# Altium project STC8H8K64U流水灯.PrjPcb
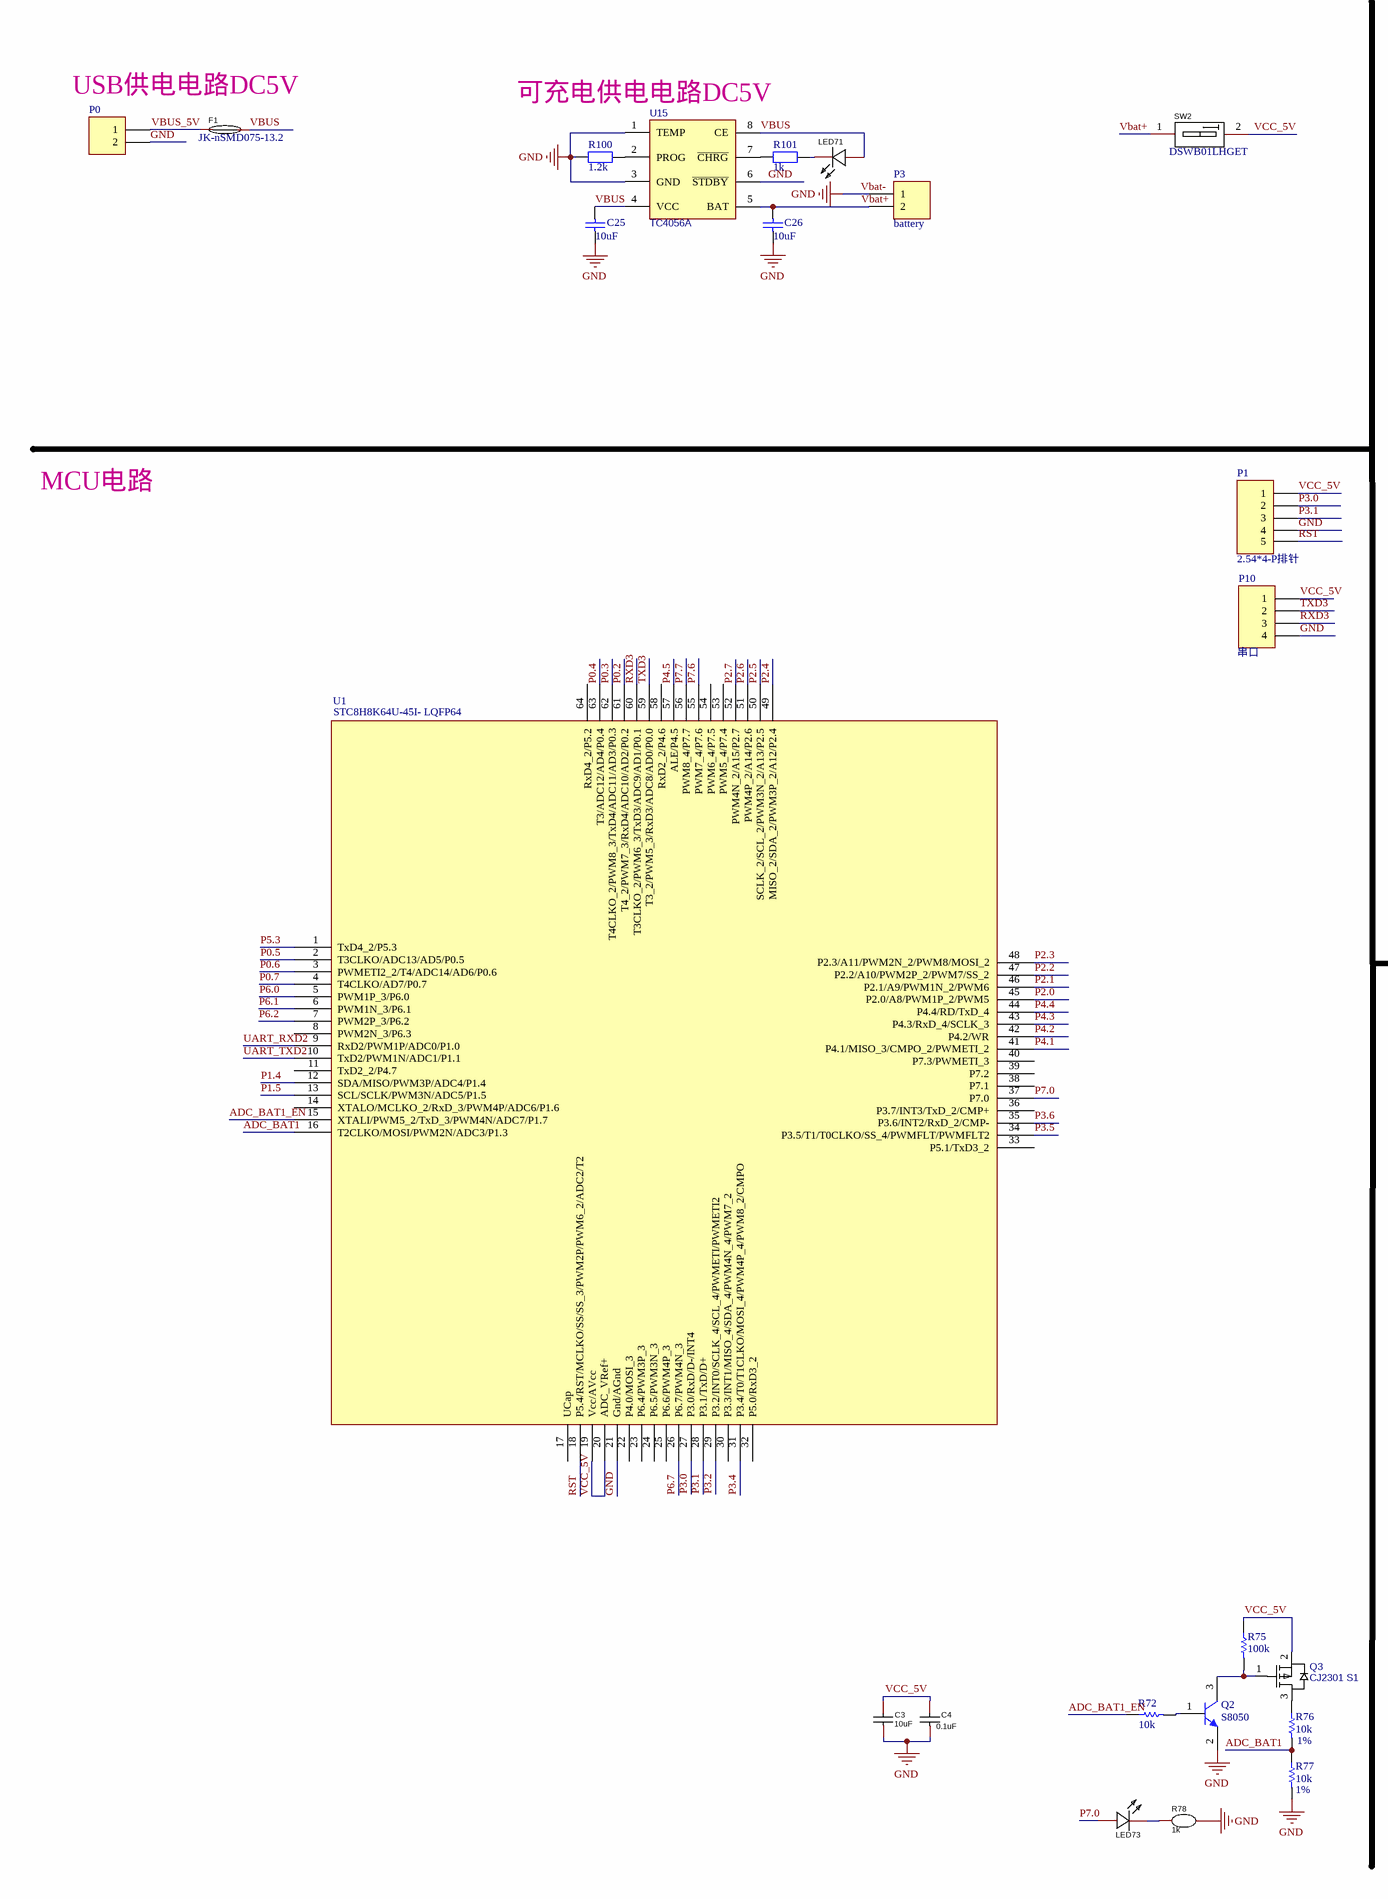
[diagram p0: STC8H8K64U流水灯.SchDoc, left]
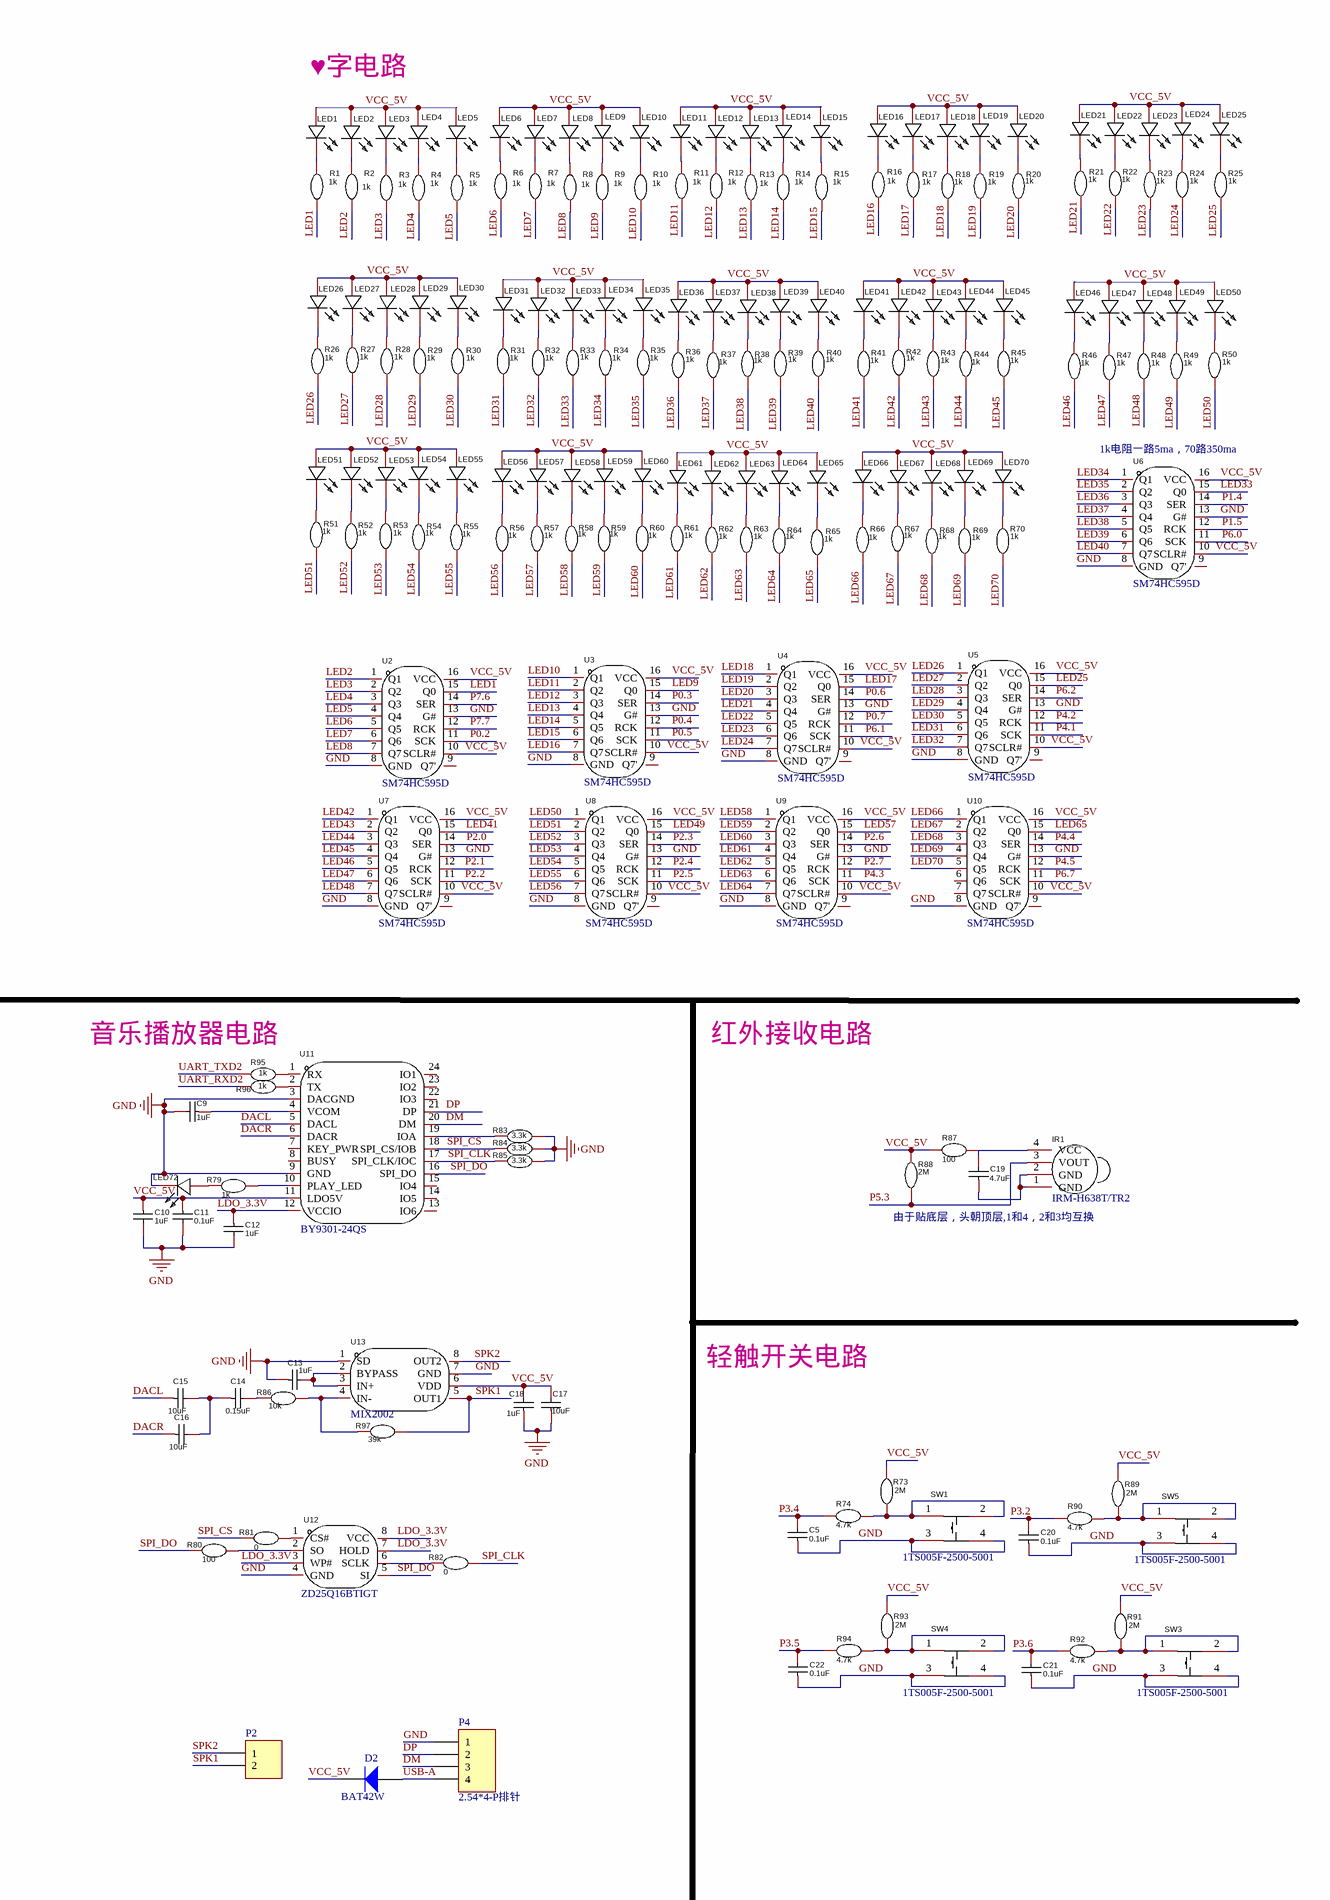
[diagram p1: STC8H8K64U流水灯.SchDoc, right]
1 sheet, 220 parts. Net scope: global (net labels, ports and power ports of the same name join across sheets).
Board file: STC8H8K64U流水灯.PcbDoc

## Sheet STC8H8K64U流水灯.SchDoc
size A2; SheetNumber: 1; SheetTotal: 1; PageSetup: Record=PageOptions|CenterHorizontal=True|CenterVertical=True|PrintScale=0.73|XCorrection=1.00|YCorrection=1.00|PrintKind=0|BorderSize=5000000|LeftOffset=0|BottomOffset=0|Orientation=2|PaperLength=1000|PaperWidth=1000|Scale=100|PaperSource=7|PrintQuality=-3|MediaType=1|DitherType=10|PaperKind=A4|PrintScaleMode=1

### Parts
C3  value 10uF  [C0603]
C4  value 0.1uF  [C0603]
C5  value 0.1uF  [C0603]
C9  value 1uF  [C0603]
C10  value 1uF  [C0603]
C11  value 0.1uF  [C0603]
C12  value 1uF  [C0603]
C13  value 1uF  [C0603]
C14  value 0.15uF  [C0603]
C15  value 10uF  [C0603]
C16  value 10uF  [C0603]
C17  value 10uF  [C0603]
C18  value 1uF  [C0603]
C19  value 4.7uF  [C0603]
C20  value 0.1uF  [C0603]
C21  value 0.1uF  [C0603]
C22  value 0.1uF  [C0603]
C25  value 10uF  [C0603]  (hidden comment: Cap)
C26  value 10uF  [C0603]  (hidden comment: Cap)
D2  BAT42W  [SOD-123]
F1  JK-nSMD075-13.2  [F1206]
IR1  IRM-H638T/TR2  [SMD-4P_IRM-H638T/TR2]
LED1  TLMG1100-GS08  [LED0603]  (value not drawn)
LED2  TLMG1100-GS08  [LED0603]  (value not drawn)
LED3  TLMG1100-GS08  [LED0603]  (value not drawn)
LED4  TLMG1100-GS08  [LED0603]  (value not drawn)
LED5  TLMG1100-GS08  [LED0603]  (value not drawn)
LED6  TLMG1100-GS08  [LED0603]  (value not drawn)
LED7  TLMG1100-GS08  [LED0603]  (value not drawn)
LED8  TLMG1100-GS08  [LED0603]  (value not drawn)
LED9  TLMG1100-GS08  [LED0603]  (value not drawn)
LED10  TLMG1100-GS08  [LED0603]  (value not drawn)
LED11  TLMG1100-GS08  [LED0603]  (value not drawn)
LED12  TLMG1100-GS08  [LED0603]  (value not drawn)
LED13  TLMG1100-GS08  [LED0603]  (value not drawn)
LED14  TLMG1100-GS08  [LED0603]  (value not drawn)
LED15  TLMG1100-GS08  [LED0603]  (value not drawn)
LED16  TLMG1100-GS08  [LED0603]  (value not drawn)
LED17  TLMG1100-GS08  [LED0603]  (value not drawn)
LED18  TLMG1100-GS08  [LED0603]  (value not drawn)
LED19  TLMG1100-GS08  [LED0603]  (value not drawn)
LED20  TLMG1100-GS08  [LED0603]  (value not drawn)
LED21  TLMG1100-GS08  [LED0603]  (value not drawn)
LED22  TLMG1100-GS08  [LED0603]  (value not drawn)
LED23  TLMG1100-GS08  [LED0603]  (value not drawn)
LED24  TLMG1100-GS08  [LED0603]  (value not drawn)
LED25  TLMG1100-GS08  [LED0603]  (value not drawn)
LED26  TLMG1100-GS08  [LED0603]  (value not drawn)
LED27  TLMG1100-GS08  [LED0603]  (value not drawn)
LED28  TLMG1100-GS08  [LED0603]  (value not drawn)
LED29  TLMG1100-GS08  [LED0603]  (value not drawn)
LED30  TLMG1100-GS08  [LED0603]  (value not drawn)
LED31  TLMG1100-GS08  [LED0603]  (value not drawn)
LED32  TLMG1100-GS08  [LED0603]  (value not drawn)
LED33  TLMG1100-GS08  [LED0603]  (value not drawn)
LED34  TLMG1100-GS08  [LED0603]  (value not drawn)
LED35  TLMG1100-GS08  [LED0603]  (value not drawn)
LED36  TLMG1100-GS08  [LED0603]  (value not drawn)
LED37  TLMG1100-GS08  [LED0603]  (value not drawn)
LED38  TLMG1100-GS08  [LED0603]  (value not drawn)
LED39  TLMG1100-GS08  [LED0603]  (value not drawn)
LED40  TLMG1100-GS08  [LED0603]  (value not drawn)
LED41  TLMG1100-GS08  [LED0603]  (value not drawn)
LED42  TLMG1100-GS08  [LED0603]  (value not drawn)
LED43  TLMG1100-GS08  [LED0603]  (value not drawn)
LED44  TLMG1100-GS08  [LED0603]  (value not drawn)
LED45  TLMG1100-GS08  [LED0603]  (value not drawn)
LED46  TLMG1100-GS08  [LED0603]  (value not drawn)
LED47  TLMG1100-GS08  [LED0603]  (value not drawn)
LED48  TLMG1100-GS08  [LED0603]  (value not drawn)
LED49  TLMG1100-GS08  [LED0603]  (value not drawn)
LED50  TLMG1100-GS08  [LED0603]  (value not drawn)
LED51  TLMG1100-GS08  [LED0603]  (value not drawn)
LED52  TLMG1100-GS08  [LED0603]  (value not drawn)
LED53  TLMG1100-GS08  [LED0603]  (value not drawn)
LED54  TLMG1100-GS08  [LED0603]  (value not drawn)
LED55  TLMG1100-GS08  [LED0603]  (value not drawn)
LED56  TLMG1100-GS08  [LED0603]  (value not drawn)
LED57  TLMG1100-GS08  [LED0603]  (value not drawn)
LED58  TLMG1100-GS08  [LED0603]  (value not drawn)
LED59  TLMG1100-GS08  [LED0603]  (value not drawn)
LED60  TLMG1100-GS08  [LED0603]  (value not drawn)
LED61  TLMG1100-GS08  [LED0603]  (value not drawn)
LED62  TLMG1100-GS08  [LED0603]  (value not drawn)
LED63  TLMG1100-GS08  [LED0603]  (value not drawn)
LED64  TLMG1100-GS08  [LED0603]  (value not drawn)
LED65  TLMG1100-GS08  [LED0603]  (value not drawn)
LED66  TLMG1100-GS08  [LED0603]  (value not drawn)
LED67  TLMG1100-GS08  [LED0603]  (value not drawn)
LED68  TLMG1100-GS08  [LED0603]  (value not drawn)
LED69  TLMG1100-GS08  [LED0603]  (value not drawn)
LED70  TLMG1100-GS08  [LED0603]  (value not drawn)
LED71  TLMG1100-GS08  [LED0603]  (value not drawn)
LED72  TLMG1100-GS08  [LED0603]  (value not drawn)
LED73  TLMG1100-GS08  [LED0603]  (value not drawn)
P0  (no value)  [STM-2P]
P1  2.54*4-P排针  [STM-5P]
P2  (no value)  [STM-2P]
P3  battery  [STM-2P]
P4  2.54*4-P排针  [STM-4P]
P10  串口  [STM-4P]
Q2  S8050  [SOT-23]
Q3  CJ2301 S1  [SOT-23]
R1  value 1k  [R0603]
R2  value 1k  [R0603]
R3  value 1k  [R0603]
R4  value 1k  [R0603]
R5  value 1k  [R0603]
R6  value 1k  [R0603]
R7  value 1k  [R0603]
R8  value 1k  [R0603]
R9  value 1k  [R0603]
R10  value 1k  [R0603]
R11  value 1k  [R0603]
R12  value 1k  [R0603]
R13  value 1k  [R0603]
R14  value 1k  [R0603]
R15  value 1k  [R0603]
R16  value 1k  [R0603]
R17  value 1k  [R0603]
R18  value 1k  [R0603]
R19  value 1k  [R0603]
R20  value 1k  [R0603]
R21  value 1k  [R0603]
R22  value 1k  [R0603]
R23  value 1k  [R0603]
R24  value 1k  [R0603]
R25  value 1k  [R0603]
R26  value 1k  [R0603]
R27  value 1k  [R0603]
R28  value 1k  [R0603]
R29  value 1k  [R0603]
R30  value 1k  [R0603]
R31  value 1k  [R0603]
R32  value 1k  [R0603]
R33  value 1k  [R0603]
R34  value 1k  [R0603]
R35  value 1k  [R0603]
R36  value 1k  [R0603]
R37  value 1k  [R0603]
R38  value 1k  [R0603]
R39  value 1k  [R0603]
R40  value 1k  [R0603]
R41  value 1k  [R0603]
R42  value 1k  [R0603]
R43  value 1k  [R0603]
R44  value 1k  [R0603]
R45  value 1k  [R0603]
R46  value 1k  [R0603]
R47  value 1k  [R0603]
R48  value 1k  [R0603]
R49  value 1k  [R0603]
R50  value 1k  [R0603]
R51  value 1k  [R0603]
R52  value 1k  [R0603]
R53  value 1k  [R0603]
R54  value 1k  [R0603]
R55  value 1k  [R0603]
R56  value 1k  [R0603]
R57  value 1k  [R0603]
R58  value 1k  [R0603]
R59  value 1k  [R0603]
R60  value 1k  [R0603]
R61  value 1k  [R0603]
R62  value 1k  [R0603]
R63  value 1k  [R0603]
R64  value 1k  [R0603]
R65  value 1k  [R0603]
R66  value 1k  [R0603]
R67  value 1k  [R0603]
R68  value 1k  [R0603]
R69  value 1k  [R0603]
R70  value 1k  [R0603]
R72  value 10k  [R0603]  (hidden comment: 5%)
R73  value 2M  [R0603]
R74  value 4.7k  [R0603]
R75  value 100k  [R0603]
R76  1%  value 10k  [R0603]
R77  1%  value 10k  [R0603]
R78  value 1k  [R0603]
R79  value 1k  [R0603]
R80  value 100  [R0603]
R81  value 0  [R0603]
R82  value 0  [R0603]
R83  value 3.3k  [R0603]
R84  value 3.3k  [R0603]
R85  value 3.3k  [R0603]
R86  value 10k  [R0603]
R87  value 100  [R0603]
R88  value 2M  [R0603]
R89  value 2M  [R0603]
R90  value 4.7k  [R0603]
R91  value 2M  [R0603]
R92  value 4.7k  [R0603]
R93  value 2M  [R0603]
R94  value 4.7k  [R0603]
R95  value 1k  [R0603]
R96  value 1k  [R0603]
R97  value 39k  [R0603]
R100  value 1.2k  [R0603]  (hidden comment: Res2)
R101  value 1k  [R0603]  (hidden comment: Res2)
SW1  1TS005F-2500-5001  [KEY-SMD_4P-L6.0-W6.0]
SW2  DSWB01LHGET  [STM-2P]
SW3  1TS005F-2500-5001  [KEY-SMD_4P-L6.0-W6.0]
SW4  1TS005F-2500-5001  [KEY-SMD_4P-L6.0-W6.0]
SW5  1TS005F-2500-5001  [KEY-SMD_4P-L6.0-W6.0]
U1  STC8H8K64U-45I- LQFP64  [LQFP64S(12x12)]
U2  SM74HC595D  [SOP-16]
U3  SM74HC595D  [SOP-16]
U4  SM74HC595D  [SOP-16]
U5  SM74HC595D  [SOP-16]
U6  SM74HC595D  [SOP-16]
U7  SM74HC595D  [SOP-16]
U8  SM74HC595D  [SOP-16]
U9  SM74HC595D  [SOP-16]
U10  SM74HC595D  [SOP-16]
U11  BY9301-24QS  [QSOP-24]
U12  ZD25Q16BTIGT  [SOP-8]
U13  MIX2002  [SOP-8]
U15  TC4056A  [SOP-8-EP]

### Nets
GND: C3.1 C4.1 C5.1 C9.2 C10.2 C11.2 C12.2 C13.1 C17.1 C18.1 C20.1 C21.1 C22.1 C25.2 C26.2 LED72.2(K) P0.2 P1.4 P3.1 P4.1 P10.4 Q2.2 R77.2 R78.1 R83.2 R84.2 R85.2 R100.1 SW1.3 SW1.4 SW3.3 SW3.4 SW4.3 SW4.4 SW5.3 SW5.4 U1.21(Gnd/AGnd) U2.8(GND) U2.13(G#) U3.8(GND) U3.13(G#) U4.8(GND) U4.13(G#) U5.8(GND) U5.13(G#) U6.8(GND) U6.13(G#) U7.8(GND) U7.13(G#) U8.8(GND) U8.13(G#) U9.8(GND) U9.13(G#) U10.8(GND) U10.13(G#) U11.3(DACGND) U11.9(GND) U12.4(GND) U13.1(SD) U13.7(GND) U15.1(TEMP) U15.3(GND) U15.6(~{STDBY})  [also labelled Vbat-]
ADC_BAT1: R76.2 R77.1 U1.16(T2CLKO/MOSI/PWM2N/ADC3/P1.3)
ADC_BAT1_EN: R72.1 U1.15(XTALI/PWM5_2/TxD_3/PWM4N/ADC7/P1.7)
DACL: C15.1 U11.5(DACL)
DACR: C16.1 U11.6(DACR)
DM: P4.3 U11.20(DM)
DP: P4.2 U11.21(DP)
LDO_3.3V: C12.1 U11.12(VCCIO) U12.3(WP#) U12.7(HOLD) U12.8(VCC)
LED1: R1.1 U2.15(Q0)
LED2: R2.1 U2.1(Q1)
LED3: R3.1 U2.2(Q2)
LED4: R4.1 U2.3(Q3)
LED5: R5.1 U2.4(Q4)
LED6: R6.1 U2.5(Q5)
LED7: R7.1 U2.6(Q6)
LED8: R8.1 U2.7(Q7)
LED9: R9.1 U3.15(Q0)
LED10: R10.1 U3.1(Q1)
LED11: R11.1 U3.2(Q2)
LED12: R12.1 U3.3(Q3)
LED13: R13.1 U3.4(Q4)
LED14: R14.1 U3.5(Q5)
LED15: R15.1 U3.6(Q6)
LED16: R16.1 U3.7(Q7)
LED17: R17.1 U4.15(Q0)
LED18: R18.1 U4.1(Q1)
LED19: R19.1 U4.2(Q2)
LED20: R20.1 U4.3(Q3)
LED21: R21.1 U4.4(Q4)
LED22: R22.1 U4.5(Q5)
LED23: R23.1 U4.6(Q6)
LED24: R24.1 U4.7(Q7)
LED25: R25.1 U5.15(Q0)
LED26: R26.1 U5.1(Q1)
LED27: R27.1 U5.2(Q2)
LED28: R28.1 U5.3(Q3)
LED29: R29.1 U5.4(Q4)
LED30: R30.1 U5.5(Q5)
LED31: R31.1 U5.6(Q6)
LED32: R32.1 U5.7(Q7)
LED33: R33.1 U6.15(Q0)
LED34: R34.1 U6.1(Q1)
LED35: R35.1 U6.2(Q2)
LED36: R36.1 U6.3(Q3)
LED37: R37.1 U6.4(Q4)
LED38: R38.1 U6.5(Q5)
LED39: R39.1 U6.6(Q6)
LED40: R40.1 U6.7(Q7)
LED41: R41.1 U7.15(Q0)
LED42: R42.1 U7.1(Q1)
LED43: R43.1 U7.2(Q2)
LED44: R44.1 U7.3(Q3)
LED45: R45.1 U7.4(Q4)
LED46: R46.1 U7.5(Q5)
LED47: R47.1 U7.6(Q6)
LED48: R48.1 U7.7(Q7)
LED49: R49.1 U8.15(Q0)
LED50: R50.1 U8.1(Q1)
LED51: R51.1 U8.2(Q2)
LED52: R52.1 U8.3(Q3)
LED53: R53.1 U8.4(Q4)
LED54: R54.1 U8.5(Q5)
LED55: R55.1 U8.6(Q6)
LED56: R56.1 U8.7(Q7)
LED57: R57.1 U9.15(Q0)
LED58: R58.1 U9.1(Q1)
LED59: R59.1 U9.2(Q2)
LED60: R60.1 U9.3(Q3)
LED61: R61.1 U9.4(Q4)
LED62: R62.1 U9.5(Q5)
LED63: R63.1 U9.6(Q6)
LED64: R64.1 U9.7(Q7)
LED65: R65.1 U10.15(Q0)
LED66: R66.1 U10.1(Q1)
LED67: R67.1 U10.2(Q2)
LED68: R68.1 U10.3(Q3)
LED69: R69.1 U10.4(Q4)
LED70: R70.1 U10.5(Q5)
P0.2: U1.61(T4_2/PWM7_3/RxD4/ADC10/AD2/P0.2) U2.11(SCK)
P0.3: U1.62(T4CLKO_2/PWM8_3/TxD4/ADC11/AD3/P0.3) U3.14(SER)
P0.4: U1.63(T3/ADC12/AD4/P0.4) U3.12(RCK)
P0.5: U1.2(T3CLKO/ADC13/AD5/P0.5) U3.11(SCK)
P0.6: U1.3(PWMETI2_2/T4/ADC14/AD6/P0.6) U4.14(SER)
P0.7: U1.4(T4CLKO/AD7/P0.7) U4.12(RCK)
P1.4: U1.12(SDA/MISO/PWM3P/ADC4/P1.4) U6.14(SER)
P1.5: U1.13(SCL/SCLK/PWM3N/ADC5/P1.5) U6.12(RCK)
P2.0: U1.45(P2.0/A8/PWM1P_2/PWM5) U7.14(SER)
P2.1: U1.46(P2.1/A9/PWM1N_2/PWM6) U7.12(RCK)
P2.2: U1.47(P2.2/A10/PWM2P_2/PWM7/SS_2) U7.11(SCK)
P2.3: U1.48(P2.3/A11/PWM2N_2/PWM8/MOSI_2) U8.14(SER)
P2.4: U1.49(MISO_2/SDA_2/PWM3P_2/A12/P2.4) U8.12(RCK)
P2.5: U1.50(SCLK_2/SCL_2/PWM3N_2/A13/P2.5) U8.11(SCK)
P2.6: U1.51(PWM4P_2/A14/P2.6) U9.14(SER)
P2.7: U1.52(PWM4N_2/A15/P2.7) U9.12(RCK)
P3.0: P1.2 U1.27(P3.0/RxD/D-/INT4)
P3.1: P1.3 U1.28(P3.1/TxD/D+)
P3.2: C20.2 R90.2 U1.29(P3.2/INT0/SCLK_4/SCL_4/PWMETI/PWMETI2)
P3.4: C5.2 R74.2 U1.31(P3.4/T0/T1CLKO/MOSI_4/PWM4P_4/PWM8_2/CMPO)
P3.5: C22.2 R94.2 U1.34(P3.5/T1/T0CLKO/SS_4/PWMFLT/PWMFLT2)
P3.6: C21.2 R92.2 U1.35(P3.6/INT2/RxD_2/CMP-)
P4.1: U1.41(P4.1/MISO_3/CMPO_2/PWMETI_2) U5.11(SCK)
P4.2: U1.42(P4.2/WR) U5.12(RCK)
P4.3: U1.43(P4.3/RxD_4/SCLK_3) U9.11(SCK)
P4.4: U1.44(P4.4/RD/TxD_4) U10.14(SER)
P4.5: U1.57(ALE/P4.5) U10.12(RCK)
P5.3: IR1.3(VOUT) R88.1 U1.1(TxD4_2/P5.3)
P6.0: U1.5(PWM1P_3/P6.0) U6.11(SCK)
P6.1: U1.6(PWM1N_3/P6.1) U4.11(SCK)
P6.2: U1.7(PWM2P_3/P6.2) U5.14(SER)
P6.7: U1.26(P6.7/PWM4N_3) U10.11(SCK)
P7.0: LED73.1(A) U1.37(P7.0)
P7.6: U1.55(PWM7_4/P7.6) U2.14(SER)
P7.7: U1.56(PWM8_4/P7.7) U2.12(RCK)
RST: P1.5 U1.18(P5.4/RST/MCLKO/SS/SS_3/PWM2P/PWM6_2/ADC2/T2)
RXD3: P10.3 U1.60(T3CLKO_2/PWM6_3/TxD3/ADC9/AD1/P0.1)
SPI_CLK: R82.2 R85.1 U11.17(SPI_CLK/IOC)
SPI_CS: R81.1 R84.1 U11.18(SPI_CS/IOB)
SPI_DO: R80.1 U11.16(SPI_DO) U12.5(SI)
SPK1: P2.2 R97.2 U13.5(OUT1)
SPK2: P2.1 U13.8(OUT2)
TXD3: P10.2 U1.59(T3_2/PWM5_3/RxD3/ADC8/AD0/P0.0)
UART_RXD2: R96.1 U1.9(RxD2/PWM1P/ADC0/P1.0)
UART_TXD2: R95.1 U1.10(TxD2/PWM1N/ADC1/P1.1)
USB-A: D2.1(A) P4.4
Vbat+: C26.1 P3.2 SW2.1(A1) U15.5(BAT)
VBUS: C25.1 F1.2 LED71.1(A) U15.4(VCC) U15.8(CE)
VBUS_5V: F1.1 P0.1
VCC_5V: C3.2 C4.2 C10.1 C11.1 C17.2 C18.2 D2.2(K) LED1.1(A) LED2.1(A) LED3.1(A) LED4.1(A) LED5.1(A) LED6.1(A) LED7.1(A) LED8.1(A) LED9.1(A) LED10.1(A) LED11.1(A) LED12.1(A) LED13.1(A) LED14.1(A) LED15.1(A) LED16.1(A) LED17.1(A) LED18.1(A) LED19.1(A) LED20.1(A) LED21.1(A) LED22.1(A) LED23.1(A) LED24.1(A) LED25.1(A) LED26.1(A) LED27.1(A) LED28.1(A) LED29.1(A) LED30.1(A) LED31.1(A) LED32.1(A) LED33.1(A) LED34.1(A) LED35.1(A) LED36.1(A) LED37.1(A) LED38.1(A) LED39.1(A) LED40.1(A) LED41.1(A) LED42.1(A) LED43.1(A) LED44.1(A) LED45.1(A) LED46.1(A) LED47.1(A) LED48.1(A) LED49.1(A) LED50.1(A) LED51.1(A) LED52.1(A) LED53.1(A) LED54.1(A) LED55.1(A) LED56.1(A) LED57.1(A) LED58.1(A) LED59.1(A) LED60.1(A) LED61.1(A) LED62.1(A) LED63.1(A) LED64.1(A) LED65.1(A) LED66.1(A) LED67.1(A) LED68.1(A) LED69.1(A) LED70.1(A) P1.1 P10.1 Q3.2(S) R73.2 R75.1 R87.2 R88.2 R89.2 R91.2 R93.2 SW2.2 U1.19(Vcc/AVcc) U1.20(ADC_VRef+) U2.10(SCLR#) U2.16(VCC) U3.10(SCLR#) U3.16(VCC) U4.10(SCLR#) U4.16(VCC) U5.10(SCLR#) U5.16(VCC) U6.10(SCLR#) U6.16(VCC) U7.10(SCLR#) U7.16(VCC) U8.10(SCLR#) U8.16(VCC) U9.10(SCLR#) U9.16(VCC) U10.10(SCLR#) U10.16(VCC) U11.11(LDO5V) U13.6(VDD)
NetC9_1: C9.1 U11.4(VCOM)
NetC13_2: C13.2 U13.2(BYPASS) U13.3(IN+)
NetC14_1: C14.1 C15.2 C16.2
NetC14_2: C14.2 R86.1
NetC19_1: C19.1 IR1.1(GND) IR1.2(GND)
NetC19_2: C19.2 IR1.4(VCC) R87.1
NetLED1_2: LED1.2(K) R1.2
NetLED2_2: LED2.2(K) R2.2
NetLED3_2: LED3.2(K) R3.2
NetLED4_2: LED4.2(K) R4.2
NetLED5_2: LED5.2(K) R5.2
NetLED6_2: LED6.2(K) R6.2
NetLED7_2: LED7.2(K) R7.2
NetLED8_2: LED8.2(K) R8.2
NetLED9_2: LED9.2(K) R9.2
NetLED10_2: LED10.2(K) R10.2
NetLED11_2: LED11.2(K) R11.2
NetLED12_2: LED12.2(K) R12.2
NetLED13_2: LED13.2(K) R13.2
NetLED14_2: LED14.2(K) R14.2
NetLED15_2: LED15.2(K) R15.2
NetLED16_2: LED16.2(K) R16.2
NetLED17_2: LED17.2(K) R17.2
NetLED18_2: LED18.2(K) R18.2
NetLED19_2: LED19.2(K) R19.2
NetLED20_2: LED20.2(K) R20.2
NetLED21_2: LED21.2(K) R21.2
NetLED22_2: LED22.2(K) R22.2
NetLED23_2: LED23.2(K) R23.2
NetLED24_2: LED24.2(K) R24.2
NetLED25_2: LED25.2(K) R25.2
NetLED26_2: LED26.2(K) R26.2
NetLED27_2: LED27.2(K) R27.2
NetLED28_2: LED28.2(K) R28.2
NetLED29_2: LED29.2(K) R29.2
NetLED30_2: LED30.2(K) R30.2
NetLED31_2: LED31.2(K) R31.2
NetLED32_2: LED32.2(K) R32.2
NetLED33_2: LED33.2(K) R33.2
NetLED34_2: LED34.2(K) R34.2
NetLED35_2: LED35.2(K) R35.2
NetLED36_2: LED36.2(K) R36.2
NetLED37_2: LED37.2(K) R37.2
NetLED38_2: LED38.2(K) R38.2
NetLED39_2: LED39.2(K) R39.2
NetLED40_2: LED40.2(K) R40.2
NetLED41_2: LED41.2(K) R41.2
NetLED42_2: LED42.2(K) R42.2
NetLED43_2: LED43.2(K) R43.2
NetLED44_2: LED44.2(K) R44.2
NetLED45_2: LED45.2(K) R45.2
NetLED46_2: LED46.2(K) R46.2
NetLED47_2: LED47.2(K) R47.2
NetLED48_2: LED48.2(K) R48.2
NetLED49_2: LED49.2(K) R49.2
NetLED50_2: LED50.2(K) R50.2
NetLED51_2: LED51.2(K) R51.2
NetLED52_2: LED52.2(K) R52.2
NetLED53_2: LED53.2(K) R53.2
NetLED54_2: LED54.2(K) R54.2
NetLED55_2: LED55.2(K) R55.2
NetLED56_2: LED56.2(K) R56.2
NetLED57_2: LED57.2(K) R57.2
NetLED58_2: LED58.2(K) R58.2
NetLED59_2: LED59.2(K) R59.2
NetLED60_2: LED60.2(K) R60.2
NetLED61_2: LED61.2(K) R61.2
NetLED62_2: LED62.2(K) R62.2
NetLED63_2: LED63.2(K) R63.2
NetLED64_2: LED64.2(K) R64.2
NetLED65_2: LED65.2(K) R65.2
NetLED66_2: LED66.2(K) R66.2
NetLED67_2: LED67.2(K) R67.2
NetLED68_2: LED68.2(K) R68.2
NetLED69_2: LED69.2(K) R69.2
NetLED70_2: LED70.2(K) R70.2
NetLED71_2: LED71.2(K) R101.2
NetLED72_1: LED72.1(A) R79.1
NetLED73_2: LED73.2(K) R78.2
NetQ2_1: Q2.1 R72.2
NetQ2_3: Q2.3 Q3.1(G) R75.2
NetQ3_3: Q3.3(D) R76.1
NetR73_1: R73.1 R74.1 SW1.1 SW1.2
NetR79_2: R79.2 U11.10(PLAY_LED)
NetR80_2: R80.2 U12.2(SO)
NetR81_2: R81.2 U12.1(CS#)
NetR82_1: R82.1 U12.6(SCLK)
NetR83_1: R83.1 U11.19(IOA)
NetR86_2: R86.2 R97.1 U13.4(IN-)
NetR89_1: R89.1 R90.1 SW5.1 SW5.2
NetR91_1: R91.1 R92.1 SW3.1 SW3.2
NetR93_1: R93.1 R94.1 SW4.1 SW4.2
NetR95_2: R95.2 U11.1(RX)
NetR96_2: R96.2 U11.2(TX)
NetR100_2: R100.2 U15.2(PROG)
NetR101_1: R101.1 U15.7(~{CHRG})

Not connected (* = marked no-connect by the designer): U1 8(PWM2N_3/P6.3) 11(TxD2_2/P4.7) 14(XTALO/MCLKO_2/RxD_3/PWM4P/ADC6/P1.6) 17(UCap) 22(P4.0/MOSI_3) 23(P6.4/PWM3P_3) 24(P6.5/PWM3N_3) 25(P6.6/PWM4P_3) 30(P3.3/INT1/MISO_4/SDA_4/PWM4N_4/PWM7_2) 32(P5.0/RxD3_2) 33(P5.1/TxD3_2) 36(P3.7/INT3/TxD_2/CMP+) 38(P7.1) 39(P7.2) 40(P7.3/PWMETI_3) 53(PWM5_4/P7.4) 54(PWM6_4/P7.5) 58(RxD2_2/P4.6) 64(RxD4_2/P5.2); U2 9(Q7'); U3 9(Q7'); U4 9(Q7'); U5 9(Q7'); U6 9(Q7'); U7 9(Q7'); U8 9(Q7'); U9 9(Q7'); U10 6(Q6) 7(Q7) 9(Q7'); U11 7(KEY_PWR) 8(BUSY) 13(IO6) 14(IO5) 15(IO4) 22(IO3) 23(IO2) 24(IO1)

### Notes on the sheet
- ♥字电路
- USB供电电路DC5V
- (near U15) 可充电供电电路DC5V
- (near U6) 1k电阻一路5ma，70路350ma
- MCU电路
- 音乐播放器电路
- 红外接收电路
- 由于贴底层，头朝顶层,1和4，2和3均互换
- 轻触开关电路
- Title
- Size:
- Date:
- A3
- Number:
- Time:
- Revision:
- Sheet
- of
- File:

### Library data of the parts
C3-C5 C9-C22 = C?: Manufacturer: muRata(村田); Symbol: GRM21BR60J107ME15L; Add into BOM: yes; Tolerance: ±20%; Voltage Rated: 6.3V; Temperature Coefficient: X5R; Device: GRM21BR60J107ME15L; LCSC Part Name: 100uF ±20% 6.3V; Supplier Part: C141660; Manufacturer Part: GRM21BR60J107ME15L; Supplier Footprint: 0805; JLCPCB Part Class: Extended Part; Datasheet: https://atta.szlcsc.com/upload/public/pdf/source/20171113/C141660_15105613320671115822.pdf; Supplier: LCSC; Convert to PCB: yes
  C3 C15-C17: Name: 10uF
  C4 C5 C11 C20-C22: Name: 0.1uF
  C9 C10 C12 C13 C18: Name: 1uF
  C14: Name: 0.15uF
  C19: Name: 4.7uF
C25 C26 = Cap: Capacitor; Published: 8-Jun-2000; LatestRevisionDate: 17-Jul-2002; LatestRevisionNote: Re-released for DXP Platform.; PackageReference: RAD-0.3; Publisher: Altium Limited; PackageDescription: Radial Cap, Thru-Hole; 2 Leads; 0.3 in Pin Spacing
D2 = Diode BAT18: 品牌:CJ(江苏长电/长晶); Note: Pin 2 is not connected and not drawn.; Published: 21-Mar-2003; LatestRevisionDate: 29-May-2009; LatestRevisionNote: IPC-7351 Footprint Added.; DatasheetVersion: Oct-1999; PackageVersion: Sep-2001; PackageReference: SOT-23; Publisher: Altium Limited; PackageDescription: 3-Pin SOT-23 Package 0.95 mm Pitch, 2.5 mm Lead Span; ComponentLink1Description: Manufacturer Link; ComponentLink1URL: http://www.infineon.com/; Value: BAT42W
F1 = JK-NSMD050-13.2V: 品牌： JK(金科); Manufacturer: JK(金科); Add into BOM: yes; Operating Voltage (Max): 13.2V; Hold Current: 500mA; Current Rating (Max): 100A; Trip Current: 1A; Maximum Time to Trip: 100ms; Name: JK-NSMD050-13.2V; Symbol: JK-NSMD050-13.2V; Device: JK-NSMD050-13.2V; LCSC Part Name: 贴片保险丝 1206 0.5A 13.2V  自恢复保险丝; Supplier Part: C369159; Manufacturer Part: JK-NSMD050-13.2V; Supplier Footprint: 1206; JLCPCB Part Class: Extended Part; Datasheet: https://atta.szlcsc.com/upload/public/pdf/source/20190306/C369159_FECFCD0EBFCBA1D7F654376C2B91718D.pdf; Supplier: LCSC; Convert to PCB: yes
IR1 = IRM-H638T/TR2: 品牌:EVERLIGHT(亿光); Add into BOM: yes; Supply Voltage: 2.7V~5.5V; Supply Current: 1.2mA; Half Angle: 45°@垂直；45°@水平; Name: IRM-H638T/TR2; Symbol: IRM-H638T/TR2; Device: IRM-H638T/TR2; LCSC Part Name: 45°@水平 45°@垂直; Supplier Part: C91447; Manufacturer: EVERLIGHT(亿光); Manufacturer Part: IRM-H638T/TR2; Supplier Footprint: SMD-4P,4x5mm; JLCPCB Part Class: Extended Part; Datasheet: https://atta.szlcsc.com/upload/public/pdf/source/20161219/1482143954829.pdf; Supplier: LCSC; Convert to PCB: yes; Transmission Distance: -; Center Frequency: -; Power Consumption: -; Operating Temperature: -25℃~+85℃
LED1-LED73 = TLMG1100-GS08: LED?; Manufacturer: VISHAY(威世); Add into BOM: yes; Illumination Color: 普绿/黄绿; Luminous Intensity (IF=20mA): 35mcd; Dominant Wavelength / Coordinate rank: 570nm; Name: TLMG1100-GS08; Symbol: TLMG1100-GS08; Device: TLMG1100-GS08; LCSC Part Name: 普绿/黄绿 0603; Supplier Part: C241891; Manufacturer Part: TLMG1100-GS08; Supplier Footprint: 0603; JLCPCB Part Class: Extended Part; Datasheet: https://atta.szlcsc.com/upload/public/pdf/source/20180719/C241891_3C76D4DD30CDE57601F75DEAAAECA69D.pdf; Supplier: LCSC; Convert to PCB: yes; Mounting Type: 表面贴装; Correlated Color Temperature - CCT(K): -; Luminous Flux/Radiant Flux: -
P0 P3 = Header 2: Header, 2-Pin; LatestRevisionDate: 17-Jul-2002; LatestRevisionNote: Re-released for DXP Platform.; Publisher: Altium Limited
P1 = Header 5: 生产不焊接; LatestRevisionDate: 17-Jul-2002; LatestRevisionNote: Re-released for DXP Platform.; Publisher: Altium Limited; Value: *
P2 = Header 2: SM对插线母头（大头）P=2.5mm; Value: 焊线; LatestRevisionDate: 17-Jul-2002; LatestRevisionNote: Re-released for DXP Platform.; Publisher: Altium Limited
P4 = Header 4: 生产不焊接; LatestRevisionDate: 17-Jul-2002; LatestRevisionNote: Re-released for DXP Platform.; Publisher: Altium Limited; Value: *
P10 = Header 4: 2.54*4-Pin; LatestRevisionDate: 17-Jul-2002; LatestRevisionNote: Re-released for DXP Platform.; Publisher: Altium Limited; Value: *
Q2 = QNPN: 品牌:CJ(江苏长电/长晶); Published: 8-Jun-2000; LatestRevisionDate: 29-May-2009; LatestRevisionNote: IPC-7351 Footprint Added.; PackageVersion: Aug-1999; PackageReference: SOT-23B; Publisher: Altium Limited; PackageDescription: 3-Pin SOT-23 Package 0.95 mm Pitch, 2.4 mm Lead Span; Value: S8050
Q3 = CJ2301 S1: 品牌:CJ(江苏长电/长晶); BOM_Manufacturer: CJ; BOM_Supplier: LCSC; BOM_Manufacturer Part: CJ2301 S1; BOM_Supplier Part: C8547; BOM_JLCPCB Part Class: Extended Part; spicePre: Q; spiceSymbolName: CJ2301 S1
R1-R70 R73 R74 R78-R86 R88-R97 = ERJPB6B1001V: Manufacturer: PANASONIC(松下); Add into BOM: yes; Symbol: ERJPB6B1001V; Device: ERJPB6B1001V; LCSC Part Name: 1KΩ(1001) ±0.1%; Supplier Part: C413712; Manufacturer Part: ERJPB6B1001V; Supplier Footprint: 0805; JLCPCB Part Class: Extended Part; Datasheet: https://atta.szlcsc.com/upload/public/pdf/source/20190821/C413712_16C6B59B4DECA51D4907C6F5D5BAEAA8.pdf; Supplier: LCSC; Convert to PCB: yes
R72 R76 R77 = Res1: Published: 8-Jun-2000; LatestRevisionDate: 17-Jul-2002; LatestRevisionNote: Re-released for DXP Platform.; PackageReference: AXIAL-0.3; Publisher: Altium Limited; PackageDescription: Axial Device, Thru-Hole; 2 Leads; 0.3 in Pin Spacing
R75 = Res1: 5%; Published: 8-Jun-2000; LatestRevisionDate: 17-Jul-2002; LatestRevisionNote: Re-released for DXP Platform.; PackageReference: AXIAL-0.3; Publisher: Altium Limited; PackageDescription: Axial Device, Thru-Hole; 2 Leads; 0.3 in Pin Spacing
R87 = ERJPB6B1001V: R; Manufacturer: PANASONIC(松下); Add into BOM: yes; Symbol: ERJPB6B1001V; Device: ERJPB6B1001V; LCSC Part Name: 1KΩ(1001) ±0.1%; Supplier Part: C413712; Manufacturer Part: ERJPB6B1001V; Supplier Footprint: 0805; JLCPCB Part Class: Extended Part; Datasheet: https://atta.szlcsc.com/upload/public/pdf/source/20190821/C413712_16C6B59B4DECA51D4907C6F5D5BAEAA8.pdf; Supplier: LCSC; Convert to PCB: yes
R100 R101 = Res2: Resistor; Published: 8-Jun-2000; LatestRevisionDate: 17-Jul-2002; LatestRevisionNote: Re-released for DXP Platform.; PackageReference: AXIAL-0.4; Publisher: Altium Limited; PackageDescription: Axial Device, Thru-Hole; 2 Leads; 0.4 in Pin Spacing
SW1 SW3-SW5 = 1TS005F-2500-5001: 品牌： HYP(鸿源精密); Add into BOM: yes; Contact Current: 50mA; Voltage Rating (DC): 12V; Power Rating: 0.6W; Insulation Resistance: 100MΩ; Circuit: 单刀单掷; Actuator Style: 圆形按钮; Actuator/Cap Color: 黑色; With Lamp: 无; Operating Force: 250gf@±50gf; Mechanical Life: 7万次; Pin Style: 鸥翼型; Switch Length: 6mm; Switch Height: 5mm; Strike Gundam: 否; Name: 1TS005F-2500-5001; Symbol: 1TS005F-2500-5001; Device: 1TS005F-2500-5001; LCSC Part Name: 6*6*5mm 立贴 轻触开关; Supplier Part: C255812; Manufacturer: HYP(鸿源精密); Manufacturer Part: 1TS005F-2500-5001; Supplier Footprint: SMD,6x6mm; JLCPCB Part Class: Extended Part; Datasheet: https://atta.szlcsc.com/upload/public/pdf/source/20180720/C255812_0808C7D708FD1FB7246546D29134BBAD.pdf; Supplier: LCSC; Convert to PCB: yes; Mounting Style: 立贴; Operating Temperature: -40℃~+90℃; Switch Width: 6mm
SW2 = DSWB01LHGET: 品牌：YE; Manufacturer: YE; Add into BOM: yes; Circuit: 单刀单掷; Number of Positions: 1; Name: DSWB01LHGET; Symbol: DSWB01LHGET; Device: DSWB01LHGET; LCSC Part Name: 红色宽体1位顶拨插件; Supplier Part: C126888; Manufacturer Part: DSWB01LHGET; Supplier Footprint: 插件; JLCPCB Part Class: Extended Part; Datasheet: https://atta.szlcsc.com/upload/public/pdf/source/20170824/C126888_1503565979649906649.pdf; Supplier: LCSC; Convert to PCB: yes; Type: 平拨,凸起式; Lead Pitch: -; Operating Life: -; Color: 红色
U1 = STC8H8K64U-64PIN
U2-U10 = SM74HC595D: 品牌：明微; Designer: U?; Symbol: SM74HC595D; Device: SM74HC595D
U11 = BY9301-24QS: 品牌：深圳百为; Manufacturer: LANKE(兰科); Name: ULN2803LVS; Add into BOM: yes; Symbol: BY9301-24QS; Device: BY9301-24QS; LCSC Part Name: BY9301-24QS; Supplier Part: BY9301-24QS; Manufacturer Part: ULN2803LVS; Supplier Footprint: QSOP-24; JLCPCB Part Class: Extended Part; Datasheet: https://atta.szlcsc.com/upload/public/pdf/source/20220112/421D3A4FF6053CAC4F10C676DC1191C4.pdf; Supplier: LCSC; Convert to PCB: yes
U12 = ZD25Q16BTIGT: 品牌：Zetta(澜智); Add into BOM: yes; Name: ZD25Q16BTIGT; Symbol: ZD25Q16BTIGT; Device: ZD25Q16BTIGT; LCSC Part Name: ZD25Q16; Supplier Part: C2759951; Manufacturer: Zetta(澜智); Manufacturer Part: ZD25Q16BTIGT; Supplier Footprint: SOP-8; JLCPCB Part Class: Extended Part; Datasheet: https://atta.szlcsc.com/upload/public/pdf/source/20210309/C2759951_DBF9957F1C804444204EE56D67712899.pdf; Supplier: LCSC; Convert to PCB: yes
U13 = MIX2002: 品牌：MIXINNO(矽诺微); Add into BOM: yes; Name: MIX2002; Symbol: MIX2002; Device: MIX2002; LCSC Part Name: MIX2002; Supplier Part: C427073; Manufacturer: MIXINNO(矽诺微); Manufacturer Part: MIX2002; Supplier Footprint: SOP-8; JLCPCB Part Class: Extended Part; Datasheet: https://atta.szlcsc.com/upload/public/pdf/source/20190906/C427073_02123AC3CD3E94722F119849E398DDEC.pdf; Supplier: LCSC; Convert to PCB: yes; Type of Power Amplifier: -; Output Power: -
U15 = TP4056M: 品牌：FM(富满); BOM_Manufacturer: TOPPOWER; SMT Type: Extend; BOM_Supplier: LCSC; BOM_Manufacturer Part: TP4056M; BOM_Supplier Part: C21417; BOM_LCSC Assembly: Yes; spicePre: U; spiceSymbolName: TP4056M